# Altium project UZ_Per_ADC_to_BNC.PrjPcb
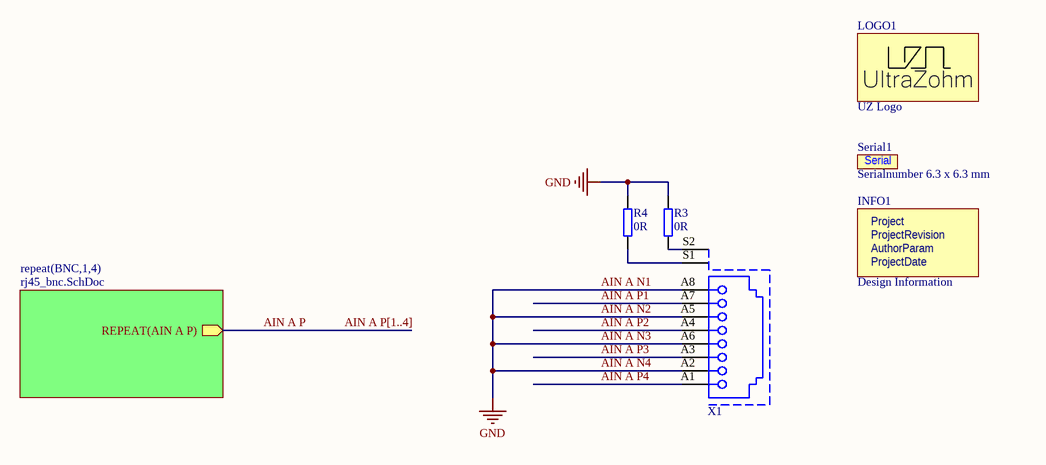
[diagram p0: Top_sheet.SchDoc]
ProjectRevision: Rev02; ProjectDate: 01/2026; Project: UZ_Per_ADC_to_BNC; AuthorParam: E. Aufderheide
2 sheets, 22 parts. Net scope: hierarchical (ports join the sheet entries above them; power ports are global).
Board file: UZ_Per_ADC_to_BNC.PcbDoc
Sheets:
  Top_sheet.SchDoc
    BNC1 = rj45_bnc.SchDoc
    BNC2 = rj45_bnc.SchDoc
    BNC3 = rj45_bnc.SchDoc
    BNC4 = rj45_bnc.SchDoc

## Sheet Top_sheet.SchDoc
size A4; Author: E. Aufderheide; CompanyName: Technische Hochschule Nürnberg Georg Simon Ohm; Organization: UltraZohm; Address1: Kesslerplatz 12; Address2: 90489 Nürnberg; Address3: GERMANY; SheetNumber: 1; SheetTotal: 2; Website: www.ultrazohm.com

### Parts
INFO1  Design Information  [Design_info]  (no BOM)
LOGO1  UZ Logo  [UZ_Logo_small]  (no BOM)
R3  0R  [R_0603_TE]
R4  0R  [R_0603_TE]
Serial1  Serialnumber 6.3 x 6.3 mm  [SERIAL_6.3X6.3MM]  (no BOM)
X1  (no value)  [R-RJ45R10P-B000]

### Sub-sheets
repeat(BNC,1,4) = rj45_bnc.SchDoc: REPEAT(AIN A P) (out)

### Nets
GND: R3.1 R4.1 X1.A2 X1.A5 X1.A6 X1.A8  [also labelled AIN A N1, AIN A N2, AIN A N3, AIN A N4]
AIN A P: sheet repeat(BNC,1,4)/REPEAT(AIN A P)
AIN A P1: X1.A7
AIN A P2: X1.A4
AIN A P3: X1.A3
AIN A P4: X1.A1
NetR3_2: R3.2 X1.S2
NetR4_2: R4.2 X1.S1

### Buses and harness runs
bus AIN A P[1..4]

### Notes on the sheet
- Title
- Revision:
- Design Engineer:
- Date:
- Project:
- Sheet
- of
- (in symbol Design Information) Project; ProjectRevision; AuthorParam; ProjectDate
- (in symbol Serial Number) Serial

### Library data of the parts
INFO1 = Design Information: Manufacturer: UltraZohm; Created from: MGremer; Manufacturer Part Number: Design Information; PartID: 12; Created On: 03.11.2021 09:04:23; ComponentLink1Description: https://docs.ultrazohm.com/; ComponentLink1URL: homepage; Component Type: Design Information; Last Updated: 03.11.2021 09:28:34; Supplier 1: -; Supplier Part Number 1: -; Type: Design Information; Value: Design Information; Live Cycle Status: 1
LOGO1 = Logo small: Manufacturer: UltraZohm; Created from: MGremer; Created: Jan2021_Liegmann; Value: Logo; Manufacturer Part Number: Logo small; PartID: 10; Created On: 03.11.2021 09:04:23; ComponentLink1Description: https://docs.ultrazohm.com/; ComponentLink1URL: homepage; Component Type: Logo; Last Updated: 03.11.2021 09:05:50; Supplier 1: -; Supplier Part Number 1: -; Type: Logo; Live Cycle Status: 1
R3 R4 = UZgen_R_0603_0R: Generic resistor; Manufacturer: UZgen; Tolerance: 1 %; Created from: UZgenTool; Manufacturer Part Number: UZgen_R_0603_0R; PartID: 581; Created On: 08.07.2024 14:34:30; Value: 0R; Device Package: 0603; Mounting Type: SMD; Last Updated: 08.07.2024 14:34:30; LCSC Part Number: C21189
Serial1 = Serial Number: Manufacturer: UltraZohm; Value: REV; Created from: MGremer; Created: 2018_09_18_AGeiger; Manufacturer Part Number: Serial Number; PartID: 11; Created On: 03.11.2021 09:04:23; ComponentLink1Description: https://docs.ultrazohm.com/; ComponentLink1URL: homepage; Component Type: Serial Number; Last Updated: 03.11.2021 09:28:34; Supplier 1: -; Supplier Part Number 1: -; Type: Serial Number; Live Cycle Status: 1
X1 = R-RJ45R10P-B000: RJ45Receptacle 1 Shielded Bend insert Without LED 0℃~+70℃ Plugin Ethernet Connectors / Modular Connectors (RJ45 RJ11) ROHS; Manufacturer: Ckmtw(Shenzhen Cankemeng); Created from: KIlhan; Manufacturer Part Number: R-RJ45R10P-B000; PartID: 57; Created On: 20.03.2025 09:19:07; ComponentLink1Description: Datasheet; ComponentLink1URL: https://jlcpcb.com/api/file/downloadByFileSystemAccessId/8588892085580021760; Last Updated: 18.05.2025 18:44:47; Mounting Type: THT; Operating Temperature: 0 °C to +70 °C; Series: RJ45; Supplier 1: LCSC; Supplier Part Number 1: C386758; Value: R-RJ45R10P-B000; LCSC Part Number: C386758

## Sheet rj45_bnc.SchDoc
size A4; Author: E. Aufderheide; CompanyName: Technische Hochschule Nürnberg Georg Simon Ohm; Organization: UltraZohm; Address1: Kesslerplatz 12; Address2: 90489 Nürnberg; Address3: GERMANY; SheetNumber: 2; SheetTotal: 2; Website: www.ultrazohm.com
Used 4 times, as channels BNC1, BNC2, BNC3, BNC4. Parts and nets are listed once, with the designators drawn on the sheet.
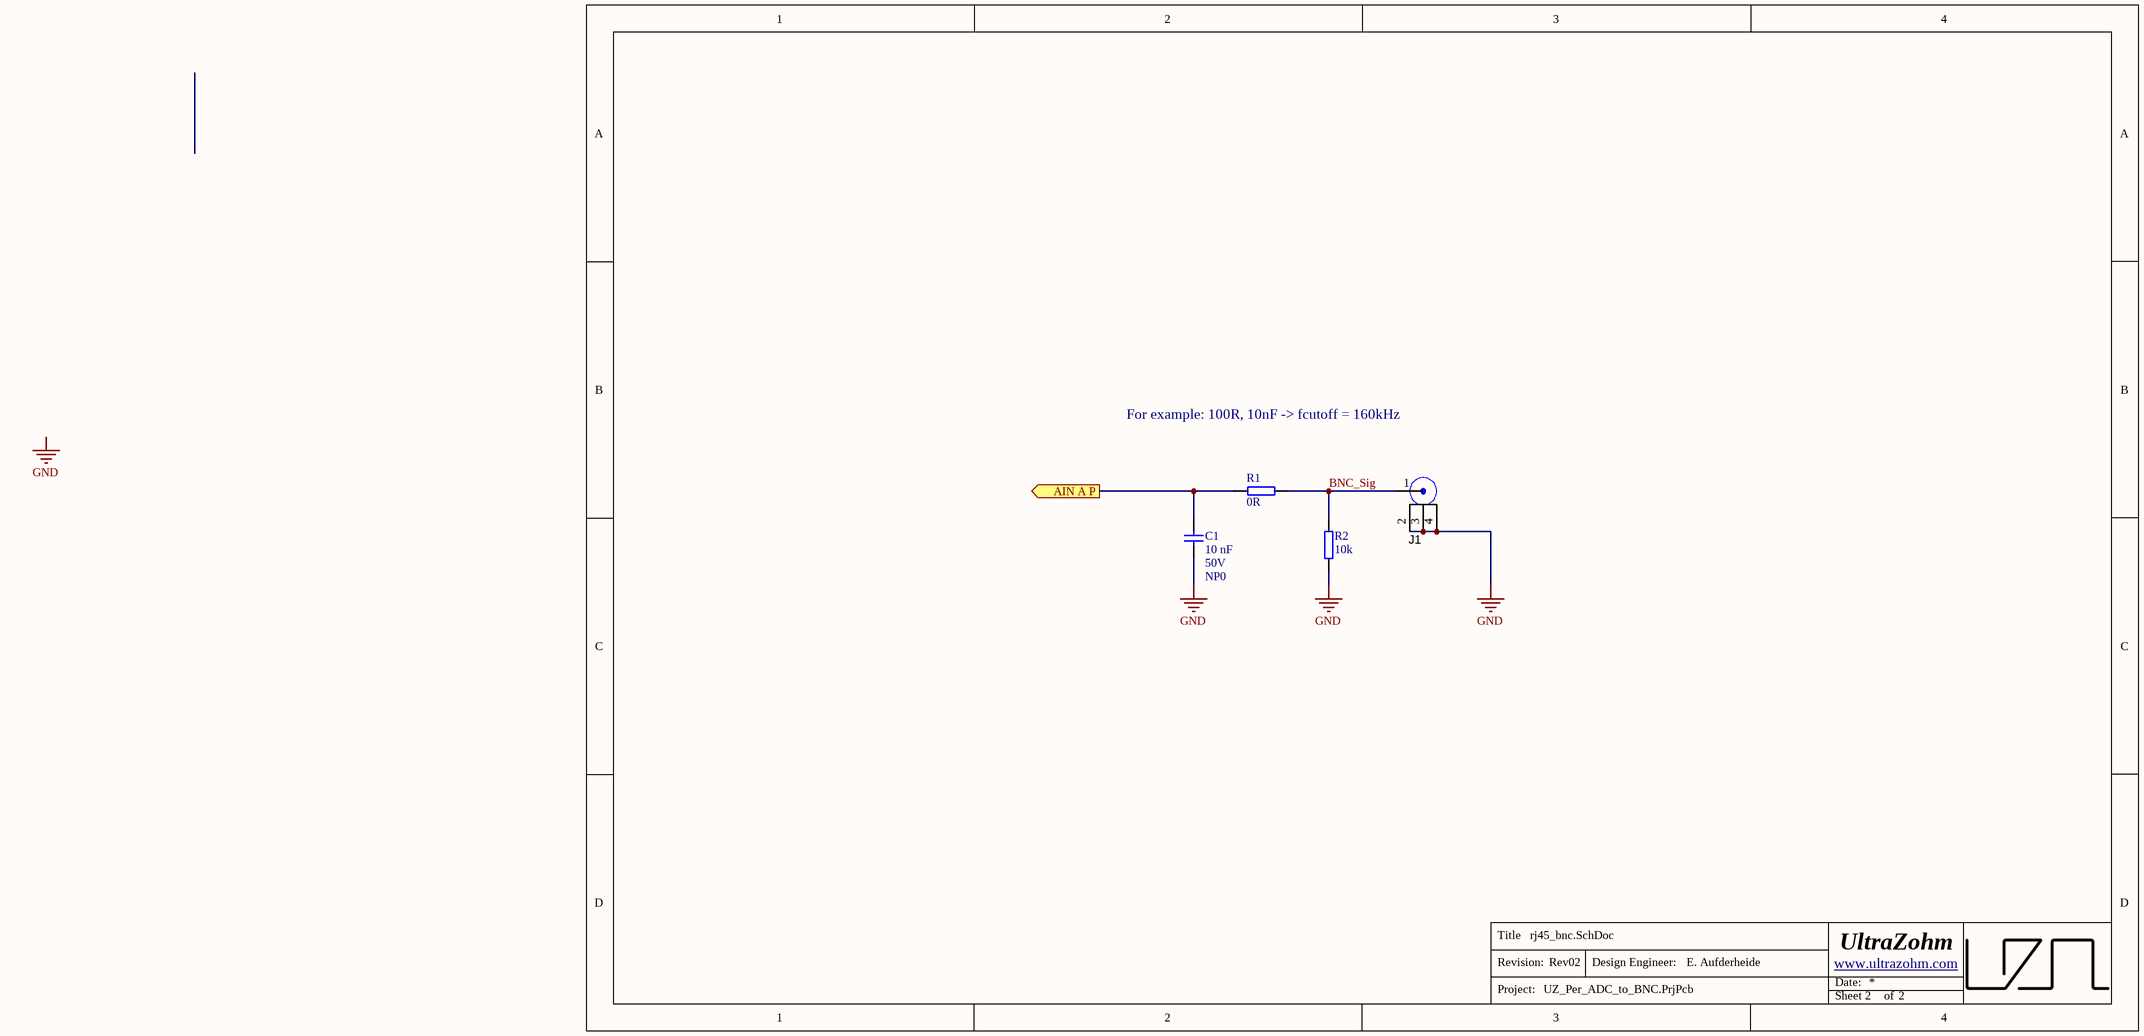
[diagram p1: rj45_bnc.SchDoc]

### Parts
C1  10 nF  Voltage: 50V  Technology: NP0  [C_0603_TE]
J1  (no value)  [Right Angle BNC]
R1  0R  [R_0603_TE]
R2  10k  [R_0603_TE]

### Ports
AIN A P (out)

### Nets
GND: C1.2 J1.2 J1.3 J1.4 R2.1
AIN A P: C1.1 R1.2 ; port AIN A P
BNC_Sig: J1.1 R1.1 R2.2

### Channels
BNC1: designators end in A; ports AIN A P=AIN A P1
BNC2: designators end in B; ports AIN A P=AIN A P2
BNC3: designators end in C; ports AIN A P=AIN A P3
BNC4: designators end in D; ports AIN A P=AIN A P4

### Notes on the sheet
- For example: 100R, 10nF -> fcutoff = 160kHz
- Labels drawn without touching a wire or pin: GND
- Title
- Revision:
- Design Engineer:
- Date:
- Project:
- Sheet
- of

### Library data of the parts
C1 = UZgen_C_0603_10nF_50V_NP0: Generic capacitor; Manufacturer: UZgen; Tolerance: 10 %; Created from: UZgenTool; Manufacturer Part Number: UZgen_C_0603_10nF_50V_NP0; PartID: 5806; Created On: 13.12.2024 11:08:49; Value: 10 nF; Device Package: 0603; Mounting Type: SMD; Last Updated: 13.12.2024 11:08:49
J1 = 5227661-1: RF Connectors / Coaxial Connectors 50 Ohm BNC Jack and Plug / right-angle; Manufacturer: TE Connectivity; PartNumber: Used in BOM report; SymbolVersion: use current date i.e. 2008-05-20; SymbolCreator: Use LDAP id; CompType: Used in some BOM reports.  Useful for finding later.; U/M: EA, IN, or GM; Created from: EAufderheide; MountType: SMT, TH, or N/A; RoHS: Used in BOM report.  Use Y or N.; PackageReference: eg:  0603, used in PnP report; ComponentLink1Description: Datasheet; ComponentLink1URL: https://www.te.com/commerce/DocumentDelivery/DDEController?Action=srchrtrv&DocNm=1307191_BNC_Connectors&DocType=Catalog%20Section&DocLang=English&PartCntxt=5227661-1&DocFormat=pdf; Alternate PartNumber: -; Alternate Manufacturer: -; Supplier 1: Mouser; Supplier Part Number 1: 571-5227661-1; Manufacturer Part Number: 5227661-1; PartID: 71; Created On: 16.01.2026 12:04:20; Last Updated: 16.01.2026 12:45:05; Mounting Type: THT; Operating Temperature: -65 °C to +125 °C; Series: BNC; Supplier 2: LCSC; Supplier Part Number 2: C2979611; Value: 5227661-1; LCSC Part Number: C2979611; Supplier 3: LCSC; Supplier Part Number 3: C305920
R1 = UZgen_R_0603_0R: as R3 on sheet Top_sheet; Manufacturer Part Number: UZgen_R_0603_0R; PartID: 581; Created On: 08.07.2024 14:34:30; Value: 0R; Device Package: 0603; Mounting Type: SMD; Last Updated: 08.07.2024 14:34:30; LCSC Part Number: C21189
R2 = UZgen_R_0603_10k: Generic resistor; Manufacturer: UZgen; Tolerance: 1 %; Created from: AGeiger; Manufacturer Part Number: UZgen_R_0603_10k; PartID: 1; Created On: 02.07.2024 14:34:53; Value: 10k; Device Package: 0603; Mounting Type: SMD; Last Updated: 02.07.2024 14:37:16

## Nets that join several sheets
GND: Top_sheet (6 pins), BNC1 (5 pins), BNC2 (5 pins), BNC3 (5 pins), BNC4 (5 pins)
AIN A P1: Top_sheet (X1.A7), BNC1 (C1A.1 R1A.2)
AIN A P2: Top_sheet (X1.A4), BNC2 (C1B.1 R1B.2)
AIN A P3: Top_sheet (X1.A3), BNC3 (C1C.1 R1C.2)
AIN A P4: Top_sheet (X1.A1), BNC4 (C1D.1 R1D.2)

## Assembly variants
Manufacturing: not fitted R2A R2B R2C R2D